# Altium project Register.PrjPcb
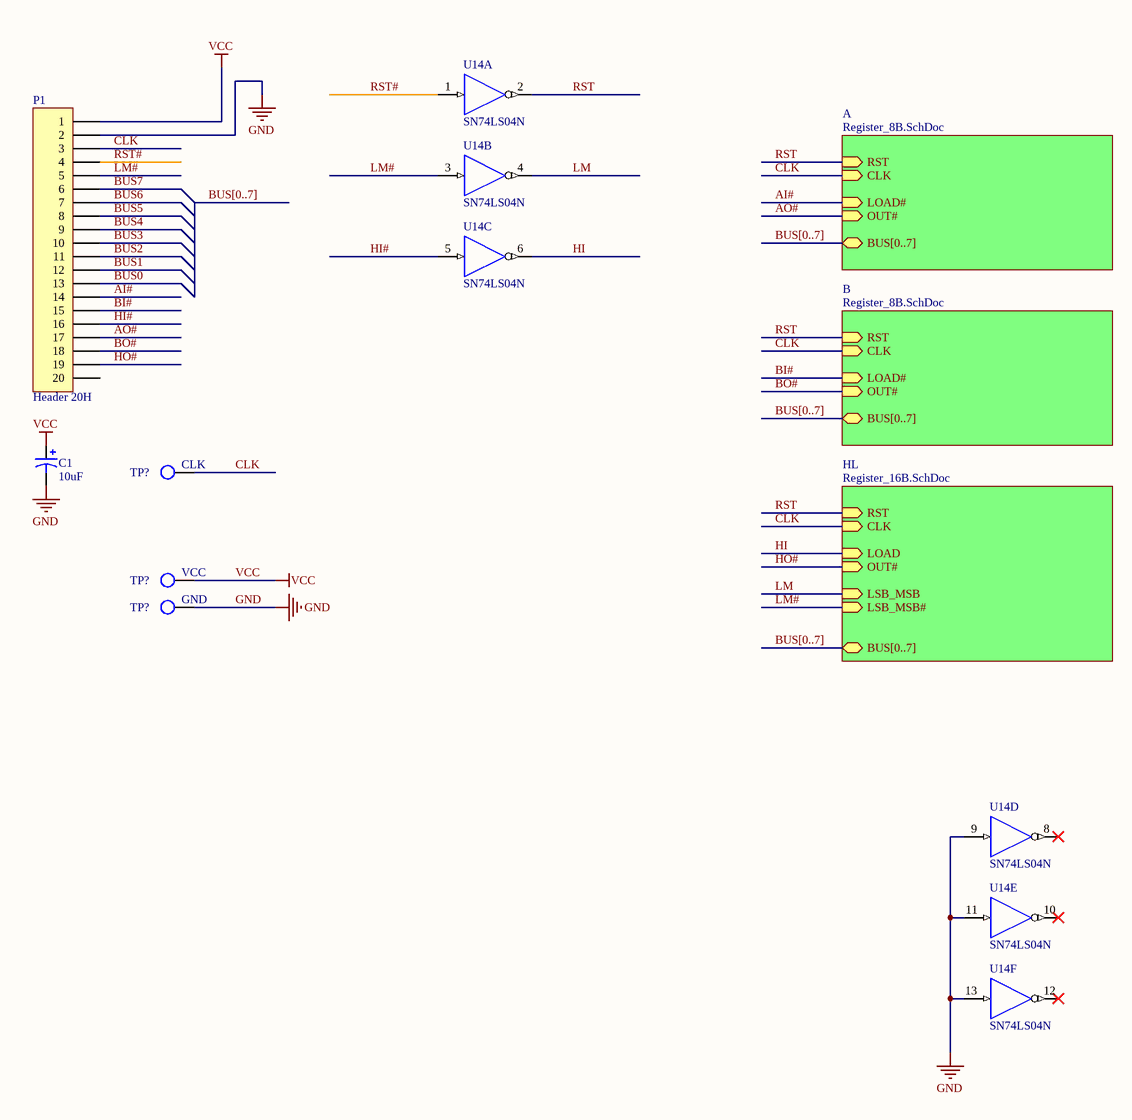
[diagram p0: Top.SchDoc]
3 sheets, 36 parts. Net scope: hierarchical (ports join the sheet entries above them; power ports are global).
Board file: Register.PcbDoc
Sheets:
  Top.SchDoc
    A = Register_8B.SchDoc
    B = Register_8B.SchDoc
    HL = Register_16B.SchDoc

## Sheet Top.SchDoc
size B; Author: E. Sims; Organization: Let's Build Rockets Inc.; SheetNumber: 1; SheetTotal: 3

### Parts
(Parts that share a designator on the sheet are numbered #1, #2 ... from top to bottom, then left to right.)
C1  value 10uF  [C5x7]  (hidden comment: Cap Pol5)
P1  Header 20H  [HDR1X20H]
TP?#1  CLK  [KSTN-5011_V]  (no BOM)
TP?#2  VCC  [KSTN-5011_V]  (no BOM)
TP?#3  GND  [KSTN-5011_V]  (no BOM)
U14  SN74LS04N  [N014]  (parts A,B,C,D,E,F of 6)

### Sub-sheets
A = Register_8B.SchDoc: RST (in), BUS[0..7] (bidir), CLK (in), OUT# (in), LOAD# (in)
B = Register_8B.SchDoc: RST (in), BUS[0..7] (bidir), CLK (in), OUT# (in), LOAD# (in)
HL = Register_16B.SchDoc: RST (in), BUS[0..7] (bidir), CLK (in), OUT# (in), LOAD (in), LSB_MSB# (in), LSB_MSB (in)

### Nets
GND: C1.2 P1.2 TP?#3.1 U14.7(GND) U14.9(A) U14.11(A) U14.13(A)
VCC: C1.1 P1.1 TP?#2.1 U14.14(VCC)
AI#: P1.14 ; sheet A/LOAD#
AO#: P1.17 ; sheet A/OUT#
BI#: P1.15 ; sheet B/LOAD#
BO#: P1.18 ; sheet B/OUT#
BUS0: P1.13
BUS1: P1.12
BUS2: P1.11
BUS3: P1.10
BUS4: P1.9
BUS5: P1.8
BUS6: P1.7
BUS7: P1.6
CLK: P1.3 TP?#1.1 ; sheet A/CLK, sheet B/CLK, sheet HL/CLK
HI: U14.6(Y) ; sheet HL/LOAD
HI#: P1.16 U14.5(A)
HO#: P1.19 ; sheet HL/OUT#
LM: U14.4(Y) ; sheet HL/LSB_MSB
LM#: P1.5 U14.3(A) ; sheet HL/LSB_MSB#
RST: U14.2(Y) ; sheet A/RST, sheet B/RST, sheet HL/RST
RST#: P1.4 U14.1(A)

Not connected (* = marked no-connect by the designer): P1 20; U14 8(Y)* 10(Y)* 12(Y)*

### Buses and harness runs
bus BUS[0..7]
bus BUS[0..7] = sheet A/BUS[0..7]
bus BUS[0..7] = sheet B/BUS[0..7]
bus BUS[0..7] = sheet HL/BUS[0..7]

### Notes on the sheet
- Let's Build Rocket's Inc. Modular Paylaod System Based on TMP-010 Rev
  For more information visit https://github.com/LetsBuildRockets/Modular-Payload-System
  This work is licensed under CC BY-NC 4.0. To view a copy of this license, visit https://creativecommons.org/licenses/by-nc/4.0
- Title
- Size:
- Date:
- Assembly Variant:
- B
- Number:
- Time:
- Revision:
- Sheet
- of
- Author:
- File:

### Library data of the parts
C1 = Cap Pol5: Polarized Capacitor; Published: 8-Jun-2000; LatestRevisionDate: 17-Jul-2002; LatestRevisionNote: Re-released for DXP Platform.; PackageReference: POLAR0.8; Publisher: Altium Limited; PackageDescription: Polarized Capacitor; 2 Leads
P1 = Header 20H: Header, 20-Pin, Right Angle; System: Connector; LatestRevisionDate: 17-Jul-2002; LatestRevisionNote: Re-released for DXP Platform.; Publisher: Altium Limited
TP?#1-TP?#3 = TP
U14 = SN74LS04N: Hex Inverter; Published: 8-Jun-2000; LatestRevisionDate: 04-Mar-2005; LatestRevisionNote: Stylized 3D Model Added.; DatasheetVersion: Mar-1988; PackageVersion: Oct-1995; PackageReference: N014; Publisher: Altium Limited; PackageDescription: DIP; 14 Leads; Row Spacing 7.62 mm; Pitch 2.54 mm; ComponentLink1Description: Manufacturer Link; ComponentLink1URL: http://www.ti.com/; ComponentLink2Description: Datasheet; ComponentLink2URL: http://www-s.ti.com/sc/ds/sn74ls04.pdf

## Sheet Register_8B.SchDoc
size B; Author: E. Sims; Organization: Let's Build Rockets Inc.; SheetNumber: 2; SheetTotal: 3
Used 2 times, as channels A, B. Parts and nets are listed once, with the designators drawn on the sheet.
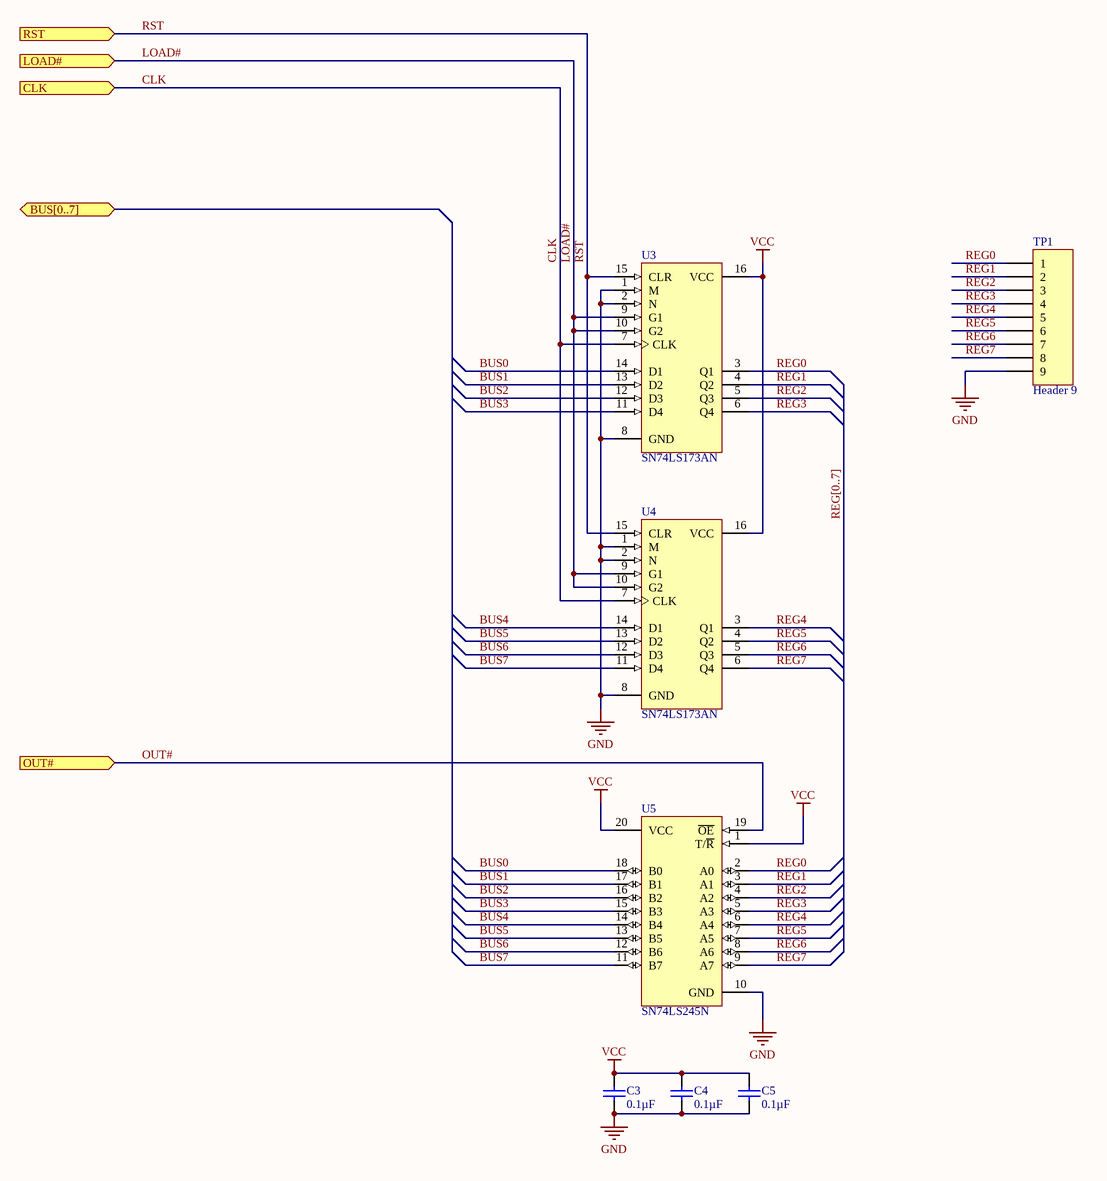
[diagram p1: Register_8B.SchDoc]

### Parts
C3  Capacitance: 0.1µF  [VISH-K104K15X7RF5TL2]  (hidden comment: K104K15X7RF5TL2)
C4  Capacitance: 0.1µF  [VISH-K104K15X7RF5TL2]  (hidden comment: K104K15X7RF5TL2)
C5  Capacitance: 0.1µF  [VISH-K104K15X7RF5TL2]  (hidden comment: K104K15X7RF5TL2)
TP1  Header 9  [HDR1X9]
U3  SN74LS173AN  [N016D]
U4  SN74LS173AN  [N016D]
U5  SN74LS245N  [N020]

### Ports
BUS[0..7] (bidir), CLK (in), LOAD# (in), OUT# (in), RST (in)

### Nets
GND: C3.2 C4.2 C5.2 TP1.9 U3.1(M) U3.2(N) U3.8(GND) U4.1(M) U4.2(N) U4.8(GND) U5.10(GND)
VCC: C3.1 C4.1 C5.1 U3.16(VCC) U4.16(VCC) U5.1(T/~{R}) U5.20(VCC)
BUS0: U3.14(D1) U5.18(B0)
BUS1: U3.13(D2) U5.17(B1)
BUS2: U3.12(D3) U5.16(B2)
BUS3: U3.11(D4) U5.15(B3)
BUS4: U4.14(D1) U5.14(B4)
BUS5: U4.13(D2) U5.13(B5)
BUS6: U4.12(D3) U5.12(B6)
BUS7: U4.11(D4) U5.11(B7)
CLK: U3.7(CLK) U4.7(CLK) ; port CLK
LOAD#: U3.9(G1) U3.10(G2) U4.9(G1) U4.10(G2) ; port LOAD#
OUT#: U5.19(~{OE}) ; port OUT#
REG0: TP1.1 U3.3(Q1) U5.2(A0)
REG1: TP1.2 U3.4(Q2) U5.3(A1)
REG2: TP1.3 U3.5(Q3) U5.4(A2)
REG3: TP1.4 U3.6(Q4) U5.5(A3)
REG4: TP1.5 U4.3(Q1) U5.6(A4)
REG5: TP1.6 U4.4(Q2) U5.7(A5)
REG6: TP1.7 U4.5(Q3) U5.8(A6)
REG7: TP1.8 U4.6(Q4) U5.9(A7)
RST: U3.15(CLR) U4.15(CLR) ; port RST

### Channels
A: designators end in _A; ports CLK=CLK LOAD#=AI# OUT#=AO# RST=RST
B: designators end in _B; ports CLK=CLK LOAD#=BI# OUT#=BO# RST=RST

### Buses and harness runs
bus REG[0..7]

### Notes on the sheet
- Let's Build Rocket's Inc. Modular Paylaod System Based on TMP-010 Rev
  For more information visit https://github.com/LetsBuildRockets/Modular-Payload-System
  This work is licensed under CC BY-NC 4.0. To view a copy of this license, visit https://creativecommons.org/licenses/by-nc/4.0
- Title
- Size:
- Date:
- Assembly Variant:
- B
- Number:
- Time:
- Revision:
- Sheet
- of
- Author:
- File:

### Library data of the parts
C3-C5 = CMP-2000-06508-1: Ceramic Capacitor, 100 nF, +/- 10%, 50 V, -55 to 125 degC, 2-Pin THD, RoHS, Tape and Reel; Manufacturer: Vishay; Other Names: BC1084CT; Catalog Drawings: Mono-KapSide2-15_5.58Mono-KapSide1_15; Temperature Coefficient: X7R; Voltage - Rated: 50V; Online Catalog: Mono-Kap™Series; Size / Dimension: 0.157"Lx0.098"W(4.00mmx2.50mm); Operating Temperature: -55°C~125°C; Family: CeramicCapacitors; Manufacturer URL: http://www.vishay.com/; Standard Package: 1; Thickness (Max): -; Ratings: -; Datasheet Version: 08/2013; Package Description: 2-Pin Through Hole Device, Body 4 x 2.6 mm; Mounting Type: ThroughHole; Features: -; Lead Spacing: 0.098"(2.50mm); Tolerance: ±10%; Category: Capacitors; Mounting Technology: ThroughHole; Lead Style: Straight; Datasheet URL: http://www.vishay.com/docs/45171/kseries.pdf; Applications: GeneralPurpose; Package / Case: Radial; Height - Seated (Max): 0.220"(5.58mm); Package Reference: K104K15X7RF5TL2; Series: Mono-Kap™K; Packaging: CutTape(CT)
TP1 = Header 9: Header, 9-Pin; LatestRevisionDate: 17-Jul-2002; LatestRevisionNote: Re-released for DXP Platform.; Publisher: Altium Limited
U3 U4 = SN74LS173AN: 4-Bit D-Type Register with 3-State Outputs; Published: 8-Jun-2000; LatestRevisionDate: 04-Mar-2005; LatestRevisionNote: Stylized 3D Model Added.; DatasheetVersion: Mar-1988; PackageVersion: Oct-1995; PackageReference: N016D; Publisher: Altium Limited; PackageDescription: DIP; 16 Leads; Row Spacing 7.62 mm; Pitch 2.54 mm; Code_JEDEC: MS-001-BB; ComponentLink1Description: Manufacturer Link; ComponentLink1URL: http://www.ti.com/; ComponentLink2Description: Datasheet; ComponentLink2URL: http://www-s.ti.com/sc/ds/sn74ls173a.pdf
U5 = SN74LS245N: Octal Bus Transceiver with 3-State Outputs; Published: 8-Jun-2000; LatestRevisionDate: 04-Mar-2005; LatestRevisionNote: Stylized 3D Model Added.; DatasheetVersion: Mar-1988; PackageVersion: Oct-1995; PackageReference: N020; Publisher: Altium Limited; PackageDescription: DIP; 20 Leads; Row Spacing 7.62 mm; Pitch 2.54 mm; ComponentLink1Description: Manufacturer Link; ComponentLink1URL: http://www.ti.com/; ComponentLink2Description: Datasheet; ComponentLink2URL: http://www-s.ti.com/sc/ds/sn74ls245.pdf

## Sheet Register_16B.SchDoc
size B; Author: E. Sims; Organization: Let's Build Rockets Inc.; SheetNumber: 3; SheetTotal: 3
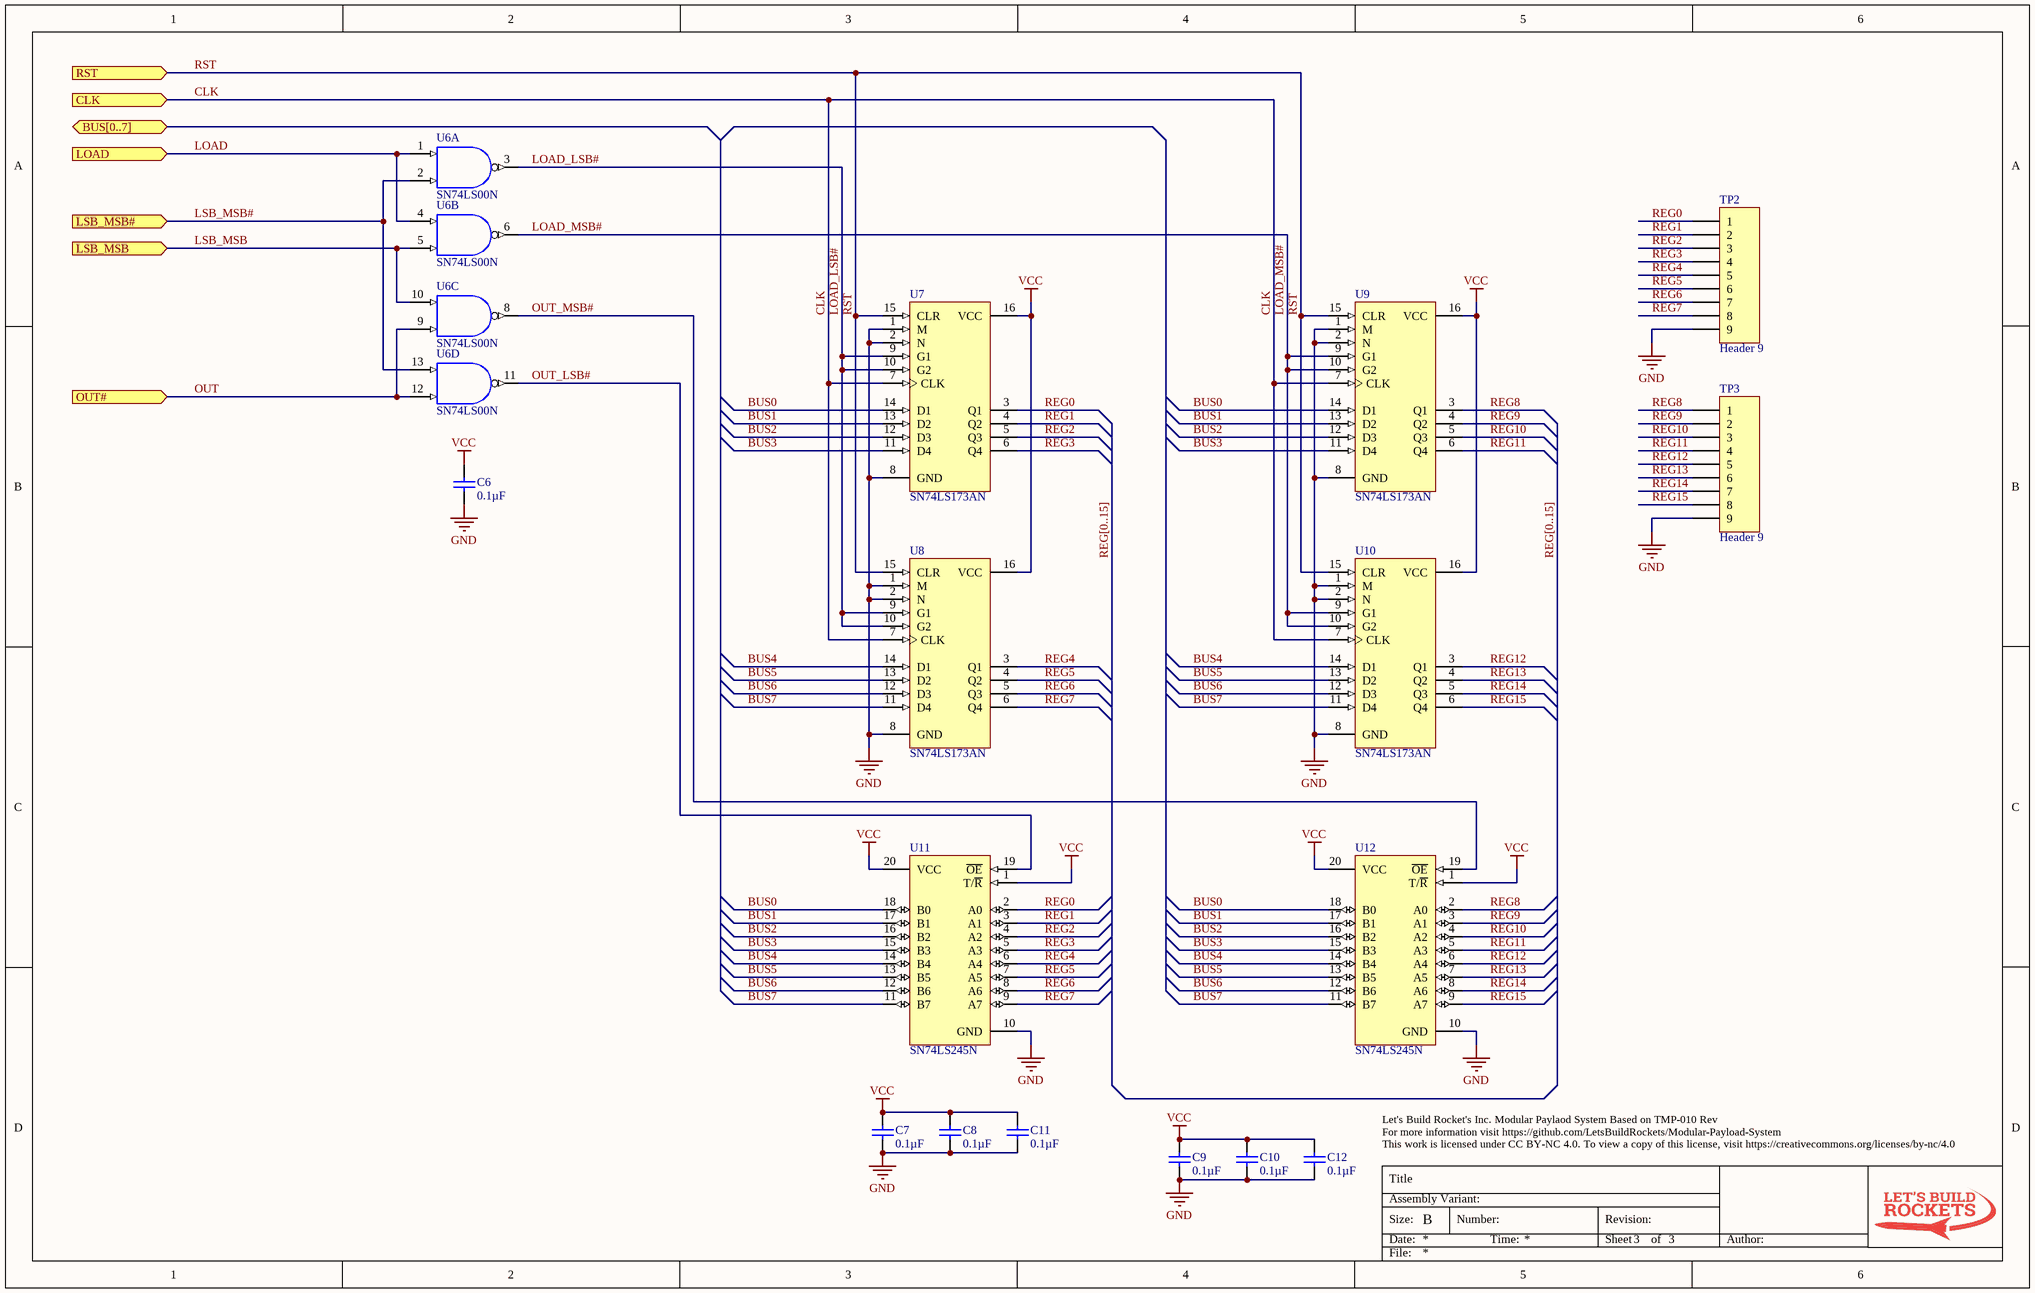
[diagram p2: Register_16B.SchDoc]

### Parts
C6  Capacitance: 0.1µF  [VISH-K104K15X7RF5TL2]  (hidden comment: K104K15X7RF5TL2)
C7  Capacitance: 0.1µF  [VISH-K104K15X7RF5TL2]  (hidden comment: K104K15X7RF5TL2)
C8  Capacitance: 0.1µF  [VISH-K104K15X7RF5TL2]  (hidden comment: K104K15X7RF5TL2)
C9  Capacitance: 0.1µF  [VISH-K104K15X7RF5TL2]  (hidden comment: K104K15X7RF5TL2)
C10  Capacitance: 0.1µF  [VISH-K104K15X7RF5TL2]  (hidden comment: K104K15X7RF5TL2)
C11  Capacitance: 0.1µF  [VISH-K104K15X7RF5TL2]  (hidden comment: K104K15X7RF5TL2)
C12  Capacitance: 0.1µF  [VISH-K104K15X7RF5TL2]  (hidden comment: K104K15X7RF5TL2)
TP2  Header 9  [HDR1X9]
TP3  Header 9  [HDR1X9]
U6  SN74LS00N  [N014]  (parts A,B,C,D of 4)
U7  SN74LS173AN  [N016D]
U8  SN74LS173AN  [N016D]
U9  SN74LS173AN  [N016D]
U10  SN74LS173AN  [N016D]
U11  SN74LS245N  [N020]
U12  SN74LS245N  [N020]

### Ports
BUS[0..7] (bidir), CLK (in), LOAD (in), LSB_MSB (in), LSB_MSB# (in), OUT# (in), RST (in)

### Nets
GND: C6.2 C7.2 C8.2 C9.2 C10.2 C11.2 C12.2 TP2.9 TP3.9 U6.7(GND) U7.1(M) U7.2(N) U7.8(GND) U8.1(M) U8.2(N) U8.8(GND) U9.1(M) U9.2(N) U9.8(GND) U10.1(M) U10.2(N) U10.8(GND) U11.10(GND) U12.10(GND)
VCC: C6.1 C7.1 C8.1 C9.1 C10.1 C11.1 C12.1 U6.14(VCC) U7.16(VCC) U8.16(VCC) U9.16(VCC) U10.16(VCC) U11.1(T/~{R}) U11.20(VCC) U12.1(T/~{R}) U12.20(VCC)
BUS0: U7.14(D1) U9.14(D1) U11.18(B0) U12.18(B0)
BUS1: U7.13(D2) U9.13(D2) U11.17(B1) U12.17(B1)
BUS2: U7.12(D3) U9.12(D3) U11.16(B2) U12.16(B2)
BUS3: U7.11(D4) U9.11(D4) U11.15(B3) U12.15(B3)
BUS4: U8.14(D1) U10.14(D1) U11.14(B4) U12.14(B4)
BUS5: U8.13(D2) U10.13(D2) U11.13(B5) U12.13(B5)
BUS6: U8.12(D3) U10.12(D3) U11.12(B6) U12.12(B6)
BUS7: U8.11(D4) U10.11(D4) U11.11(B7) U12.11(B7)
CLK: U7.7(CLK) U8.7(CLK) U9.7(CLK) U10.7(CLK) ; port CLK
LOAD: U6.1(A) U6.4(A) ; port LOAD  [project net HI]
LOAD_LSB#: U6.3(Y) U7.9(G1) U7.10(G2) U8.9(G1) U8.10(G2)
LOAD_MSB#: U6.6(Y) U9.9(G1) U9.10(G2) U10.9(G1) U10.10(G2)
LSB_MSB: U6.5(B) U6.10(B) ; port LSB_MSB  [project net LM]
LSB_MSB#: U6.2(B) U6.13(B) ; port LSB_MSB#  [project net LM#]
OUT: U6.9(A) U6.12(A) ; port OUT#  [project net HO#]
OUT_LSB#: U6.11(Y) U11.19(~{OE})
OUT_MSB#: U6.8(Y) U12.19(~{OE})
REG0: TP2.1 U7.3(Q1) U11.2(A0)
REG1: TP2.2 U7.4(Q2) U11.3(A1)
REG2: TP2.3 U7.5(Q3) U11.4(A2)
REG3: TP2.4 U7.6(Q4) U11.5(A3)
REG4: TP2.5 U8.3(Q1) U11.6(A4)
REG5: TP2.6 U8.4(Q2) U11.7(A5)
REG6: TP2.7 U8.5(Q3) U11.8(A6)
REG7: TP2.8 U8.6(Q4) U11.9(A7)
REG8: TP3.1 U9.3(Q1) U12.2(A0)
REG9: TP3.2 U9.4(Q2) U12.3(A1)
REG10: TP3.3 U9.5(Q3) U12.4(A2)
REG11: TP3.4 U9.6(Q4) U12.5(A3)
REG12: TP3.5 U10.3(Q1) U12.6(A4)
REG13: TP3.6 U10.4(Q2) U12.7(A5)
REG14: TP3.7 U10.5(Q3) U12.8(A6)
REG15: TP3.8 U10.6(Q4) U12.9(A7)
RST: U7.15(CLR) U8.15(CLR) U9.15(CLR) U10.15(CLR) ; port RST

### Buses and harness runs
bus REG[0..15]

### Notes on the sheet
- Let's Build Rocket's Inc. Modular Paylaod System Based on TMP-010 Rev
  For more information visit https://github.com/LetsBuildRockets/Modular-Payload-System
  This work is licensed under CC BY-NC 4.0. To view a copy of this license, visit https://creativecommons.org/licenses/by-nc/4.0
- Title
- Size:
- Date:
- Assembly Variant:
- B
- Number:
- Time:
- Revision:
- Sheet
- of
- Author:
- File:

### Library data of the parts
C6-C12 = CMP-2000-06508-1: as C3 on sheet Register_8B; Size / Dimension: 0.157"Lx0.098"W(4.00mmx2.50mm); Operating Temperature: -55°C~125°C; Family: CeramicCapacitors; Manufacturer URL: http://www.vishay.com/; Standard Package: 1; Thickness (Max): -; Ratings: -; Datasheet Version: 08/2013; Package Description: 2-Pin Through Hole Device, Body 4 x 2.6 mm; Mounting Type: ThroughHole; Features: -; Lead Spacing: 0.098"(2.50mm); Tolerance: ±10%; Category: Capacitors; Mounting Technology: ThroughHole; Lead Style: Straight; Datasheet URL: http://www.vishay.com/docs/45171/kseries.pdf; Applications: GeneralPurpose; Package / Case: Radial; Height - Seated (Max): 0.220"(5.58mm); Package Reference: K104K15X7RF5TL2; Series: Mono-Kap™K; Packaging: CutTape(CT)
TP2 TP3 = Header 9: Header, 9-Pin; LatestRevisionDate: 17-Jul-2002; LatestRevisionNote: Re-released for DXP Platform.; Publisher: Altium Limited
U6 = SN74LS00N: Quadruple 2-Input Positive-NAND Gate; Published: 8-Jun-2000; LatestRevisionDate: 04-Mar-2005; LatestRevisionNote: Stylized 3D Model Added.; DatasheetVersion: Mar-1988; PackageVersion: Oct-1995; PackageReference: N014; Publisher: Altium Limited; PackageDescription: DIP; 14 Leads; Row Spacing 7.62 mm; Pitch 2.54 mm; ComponentLink1Description: Manufacturer Link; ComponentLink1URL: http://www.ti.com/; ComponentLink2Description: Datasheet; ComponentLink2URL: http://www-s.ti.com/sc/ds/sn74ls00.pdf
U7-U10 = SN74LS173AN: as U3 on sheet Register_8B; Published: 8-Jun-2000; LatestRevisionDate: 04-Mar-2005; LatestRevisionNote: Stylized 3D Model Added.; DatasheetVersion: Mar-1988; PackageVersion: Oct-1995; PackageReference: N016D; Publisher: Altium Limited; PackageDescription: DIP; 16 Leads; Row Spacing 7.62 mm; Pitch 2.54 mm; Code_JEDEC: MS-001-BB; ComponentLink1Description: Manufacturer Link; ComponentLink1URL: http://www.ti.com/; ComponentLink2Description: Datasheet; ComponentLink2URL: http://www-s.ti.com/sc/ds/sn74ls173a.pdf
U11 U12 = SN74LS245N: as U5 on sheet Register_8B; Published: 8-Jun-2000; LatestRevisionDate: 04-Mar-2005; LatestRevisionNote: Stylized 3D Model Added.; DatasheetVersion: Mar-1988; PackageVersion: Oct-1995; PackageReference: N020; Publisher: Altium Limited; PackageDescription: DIP; 20 Leads; Row Spacing 7.62 mm; Pitch 2.54 mm; ComponentLink1Description: Manufacturer Link; ComponentLink1URL: http://www.ti.com/; ComponentLink2Description: Datasheet; ComponentLink2URL: http://www-s.ti.com/sc/ds/sn74ls245.pdf

## Nets that join several sheets
GND: Top (7 pins), A (11 pins), B (11 pins), Register_16B (24 pins)
VCC: Top (C1.1 P1.1 TP?#2.1 U14.14), A (7 pins), B (7 pins), Register_16B (16 pins)
AI#: Top (P1.14), A (U3_A.9 U3_A.10 U4_A.9 U4_A.10)
AO#: Top (P1.17), A (U5_A.19)
BI#: Top (P1.15), B (U3_B.9 U3_B.10 U4_B.9 U4_B.10)
BO#: Top (P1.18), B (U5_B.19)
CLK: Top (P1.3 TP?#1.1), A (U3_A.7 U4_A.7), B (U3_B.7 U4_B.7), Register_16B (U7.7 U8.7 U9.7 U10.7)
HI: Top (U14.6), Register_16B (U6.1 U6.4)
HO#: Top (P1.19), Register_16B (U6.9 U6.12)
LM: Top (U14.4), Register_16B (U6.5 U6.10)
LM#: Top (P1.5 U14.3), Register_16B (U6.2 U6.13)
RST: Top (U14.2), A (U3_A.15 U4_A.15), B (U3_B.15 U4_B.15), Register_16B (U7.15 U8.15 U9.15 U10.15)